# EAGLE design RaspiHub (EAGLE 6.5.0)
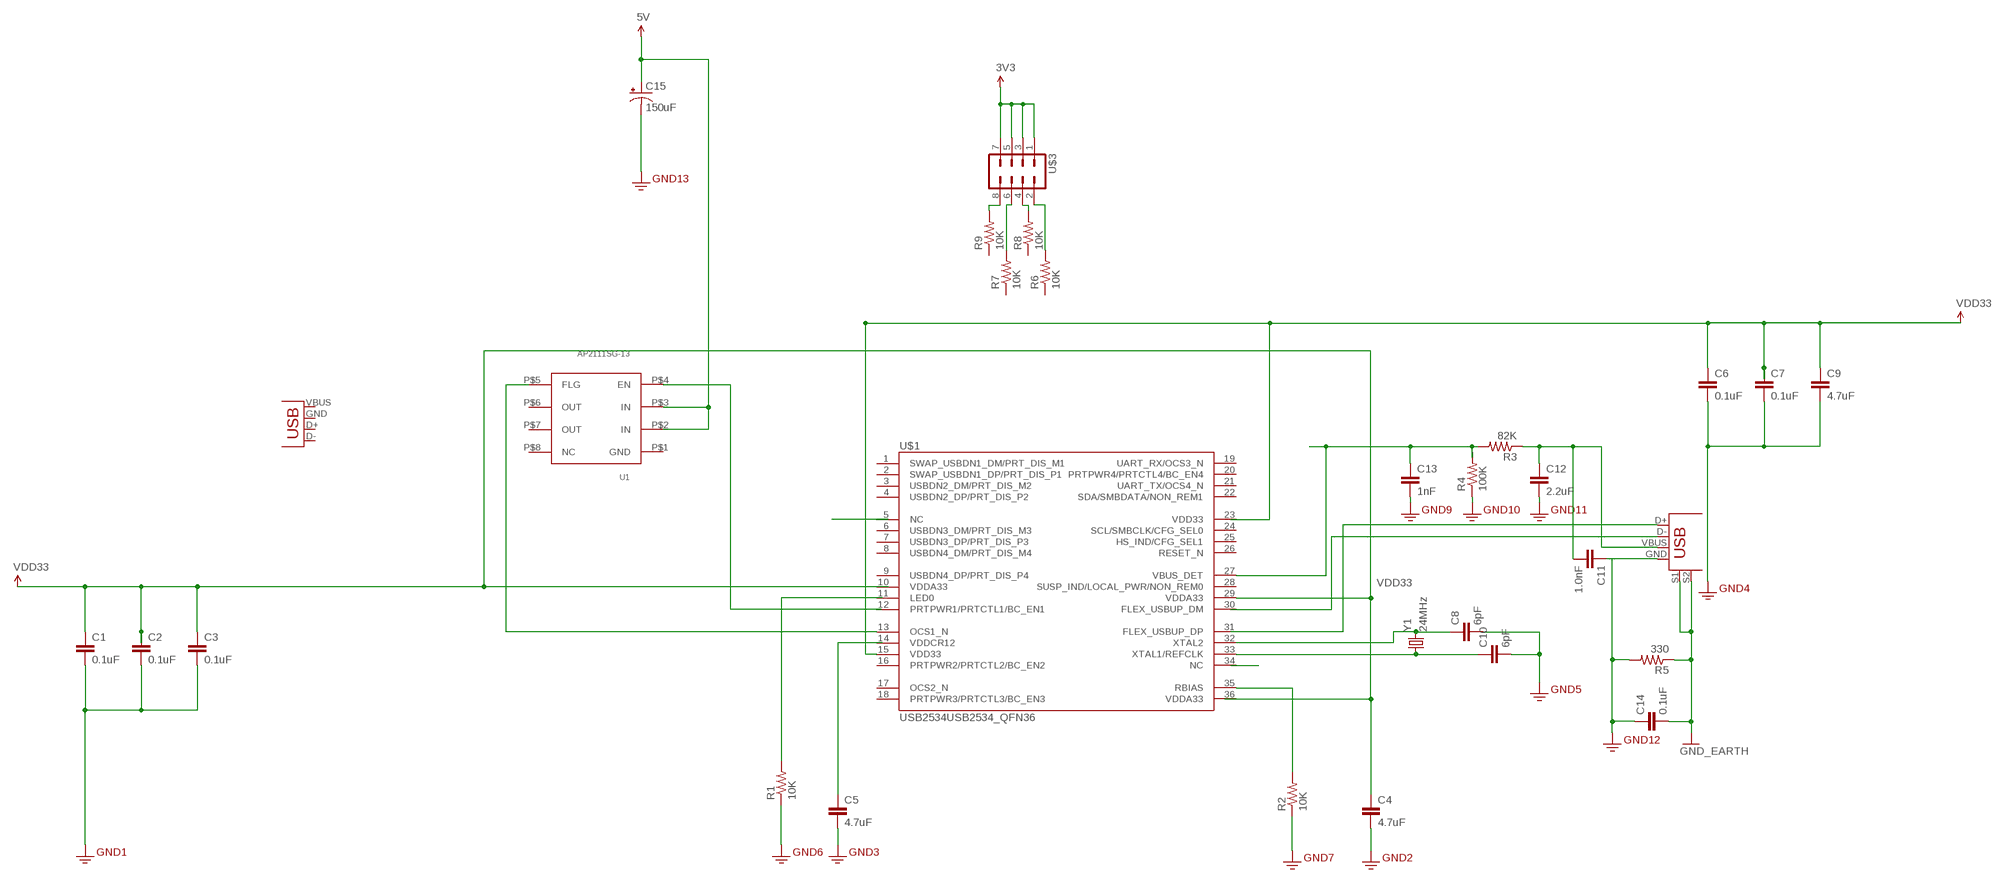
[diagram p0: schematic, sheet 1]

## Parts
C1  0.1uF  .1UF-CER  [0402-CAP]
C2  0.1uF  .1UF-CER  [0402-CAP]
C3  0.1uF  .1UF-CER  [0402-CAP]
C4  4.7uF  4.7UF-6.3V-10%(0603)0603  [0603-CAP]
C5  4.7uF  4.7UF-6.3V-10%(0603)0603  [0603-CAP]
C6  0.1uF  .1UF-CER  [0402-CAP]
C7  0.1uF  .1UF-CER  [0402-CAP]
C8  6pF  4.7UF-6.3V-10%(0603)0603  [0603-CAP]
C9  4.7uF  4.7UF-6.3V-10%(0603)0603  [0603-CAP]
C10  6pF  4.7UF-6.3V-10%(0603)0603  [0603-CAP]
C11  1.0nF  .1UF-CER  [0402-CAP]
C12  2.2uF  .1UF-CER  [0402-CAP]
C13  1nF  .1UF-CER  [0402-CAP]
C14  0.1uF  4.7UF-6.3V-10%(0603)0603  [0603-CAP]
C15  150uF  47UF-TANT  [EIA3528]
JP1  USB-A-H  [USB-A-H]
R1  10K  RESISTOR0603-RES  [0603-RES]
R2  10K  RESISTOR0603-RES  [0603-RES]
R3  82K  RESISTOR0603-RES  [0603-RES]
R4  100K  RESISTOR0603-RES  [0603-RES]
R5  330  RESISTOR0603-RES  [0603-RES]
R6  10K  RESISTOR0603-RES  [0603-RES]
R7  10K  RESISTOR0603-RES  [0603-RES]
R8  10K  RESISTOR0603-RES  [0603-RES]
R9  10K  RESISTOR0603-RES  [0603-RES]
U1  AP2111SG-13  [AP2111SG-13]
U$1  USB2534USB2534_QFN36  [USB2534]
U$2  USB+SHIELD  [USB-B-PTH]
U$3  M04X2  [2X4]
Y1  24MHz  CRYSTALHC49UV  [HC49U-V]

## Nets
3.3V: C1.2 C2.2 C3.2 C4.2 C5.2 C6.2 C7.2 C8.2 C9.2 C10.2 C12.2 C13.2 C14.1 C15.C(-) R1.1 R2.1 R4.1 R5.2 ; supply symbol labelled GND2
GND: C14.2 R5.1 U$2.S1 U$2.S2 ; supply symbol labelled GND_EARTH
N$1: C10.1 U$1.33(XTAL1/REFCLK) Y1.1
N$3: C5.1
N$5: C8.1 U$1.32(XTAL2) Y1.2
N$6: R1.2
N$7: R2.2 U$1.35(RBIAS)
N$8: U$2.D+
N$9: U$2.D-
N$10: R7.2 U$3.6
N$11: C11.2 C12.1 R3.1 U$2.VBUS
N$12: C11.1 U$2.GND
N$13: R9.2 U$3.8
N$14: R8.2 U$3.4
N$15: R6.2 U$3.2
N$16: U1.P$4(EN)
N$17: U1.P$5(FLG) U$1.13(OCS1_N)
VBUS_NET: C13.1 R3.2 U$1.27(VBUS_DET)
VCC: C6.1 C7.1 C9.1 C15.A(+) U1.P$2(IN) U1.P$3(IN) U$1.15(VDD33) U$3.1 U$3.3 U$3.5 U$3.7 ; supply symbol labelled VDD33, 3V3, 5V
VDD33: C1.1 C2.1 C3.1 U$1.29(VDDA33)
Unconnected: C4.1 JP1.D+(D-) JP1.D-(D+) JP1.GND(VBUS) JP1.VBUS(GND) R4.2 R6.1 R7.1 R8.1 R9.1 U1.P$6(OUT) U1.P$7(OUT) U1.P$8(NC) U$1.1(SWAP_USBDN1_DM/PRT_DIS_M1) U$1.2(SWAP_USBDN1_DP/PRT_DIS_P1) U$1.3(USBDN2_DM/PRT_DIS_M2) U$1.4(USBDN2_DP/PRT_DIS_P2) U$1.5(NC) U$1.6(USBDN3_DM/PRT_DIS_M3) U$1.7(USBDN3_DP/PRT_DIS_P3) U$1.8(USBDN4_DM/PRT_DIS_M4) U$1.9(USBDN4_DP/PRT_DIS_P4) U$1.10(VDDA33) U$1.11(LED0) U$1.12(PRTPWR1/PRTCTL1/BC_EN1) U$1.14(VDDCR12) U$1.16(PRTPWR2/PRTCTL2/BC_EN2) U$1.17(OCS2_N) U$1.18(PRTPWR3/PRTCTL3/BC_EN3) U$1.19(UART_RX/OCS3_N) U$1.20(PRTPWR4/PRTCTL4/BC_EN4) U$1.21(UART_TX/OCS4_N) U$1.22(SDA/SMBDATA/NON_REM1) U$1.24(SCL/SMBCLK/CFG_SEL0) U$1.25(HS_IND/CFG_SEL1) U$1.26(RESET_N) U$1.28(SUSP_IND/LOCAL_PWR/NON_REM0) U$1.30(FLEX_USBUP_DM) U$1.31(FLEX_USBUP_DP) U$1.34(NC)

## Power pins joined to a net without a drawn wire
GND: U1.P$1(GND)
VDD33: U$1.23(VDD33)
VDDA33: U$1.36(VDDA33)

## Library data of the parts
C1-C3 C6 C7 = SparkFun-Capacitors:.1UF-CER: .1uF ceramic SMT CAP-00810- 25V +80%/-20% (0603) CAP-08390- 100V 10% (0603) CAP-08604- 25V 5% (0603); PROD_ID: CAP-00810
C4 C5 C9 = SparkFun-Capacitors:4.7UF-6.3V-10%(0603): CAP-08280; PROD_ID: CAP-08280
C8 C10 C14 = SparkFun-Capacitors:4.7UF-6.3V-10%(0603): CAP-08280; PROD_ID: CAP-08280; VALUE: 4.7uF
C11-C13 = SparkFun-Capacitors:.1UF-CER: .1uF ceramic SMT CAP-00810- 25V +80%/-20% (0603) CAP-08390- 100V 10% (0603) CAP-08604- 25V 5% (0603); PROD_ID: CAP-00810; VALUE: 0.1uF
C15 = SparkFun-Capacitors:47UF-TANT: 47uF Tantalum SMT CAP-08310- 10V 10% (EIA-3528); PROD_ID: CAP-08310; VALUE: 47uF
JP1 = SparkFun-Connectors:USB: USB Connectors USB-B-PTH is fully proven SKU : PRT-00139/CONN-08278 USB-miniB is fully proven SKU : PRT-00587 USB-A-PCB is untested. USB-A-H is throughly reviewed, but untested. Spark Fun Electronics SKU : PRT-00437 USB-B-SMT is throughly reviewed, but untested. Needs silkscreen touching up. USB-A-S has not been used/tested USB-MB-H has not been used/tested USB-MICROB has been used. CONN-09505
R1-R9 = SparkFun-Resistors:RESISTOR: Resistor Basic schematic elements and footprints for 0603, 1206, and PTH resistors.
U1 = RaspiHub:AP2111SG-13: AP2111SG-13 - 2A SINGLE CHANNEL CURRENT-LIMITED POWER SWITCH Mouser: 621-AP2111SG-13
U$1 = RaspiHub:USB2534
U$2 = SparkFun-Connectors:USB+SHIELD: USB+Shield USB connector with shield pins connectable
U$3 = SparkFun-Connectors:M04X2: .1" header, two rows of four.
Y1 = SparkFun-FreqCtrl:CRYSTAL: Various standard crystals. Proven footprints. Spark Fun Electronics SKU : COM-00534

## Board
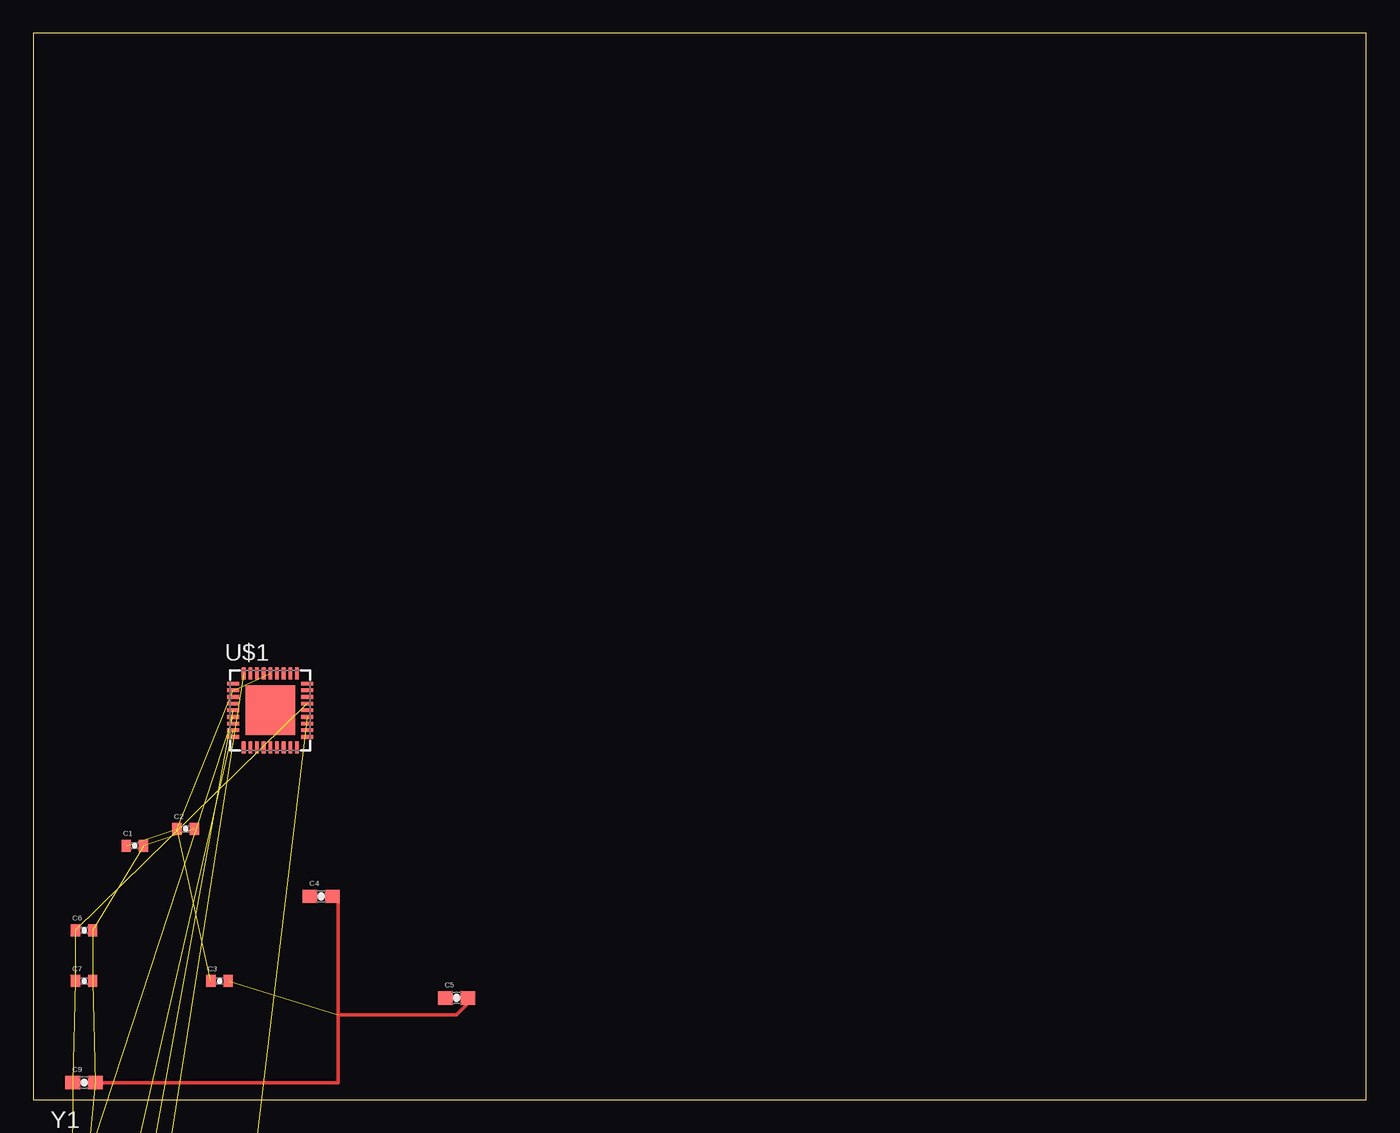
[diagram p1: board, top side]

Size 100 x 80 mm. Coordinates in mm from the lower left corner, seen from the top.
Outline: 0,0 100,0 100,80 0,80 0,0
Copper layers (1*16): Top 0.035mm / dielectric 1.5mm / Bottom 0.035mm
Design rules "default": minimum track width 10mil, minimum drill 24mil, track to track 8mil, track to pad 8mil, pad to pad 8mil, via to via 8mil, smd to smd 8mil, copper to edge 40mil, drill to drill 8mil, minimum pad ring 10mil, minimum via ring 8mil, stop-mask expansion 4mil, vias tented up to drill 0mil, thermal gap 10mil

### Footprints (pad centres in the part's own frame; a part is rotated, then mirrored left to right if it is on the bottom)
0402-CAP = smd 0.7 x 0.9: 1 -0.65,0; 2 0.65,0
0603-CAP = smd 1.1 x 1: 1 -0.85,0; 2 0.85,0
EIA3528 = smd 1.2 x 2.5: A 1.65,0; C -1.65,0
USB-A-H = drill 0.914 pad 1.88: D+ 2.4,1.127; D- 2.4,-1.127; GND 2.4,3.5; VBUS 2.4,-3.5 | drill 2.2: GND2 0,-5.8; GND3 0,5.8 | hole 1.1: -0.1,2.25; -0.1,-2.25
0603-RES = smd 1.1 x 1: 1 -0.85,0; 2 0.85,0
AP2111SG-13 = smd 0.6 x 1.55: P$1 -1.905,-2.7; P$2 -0.635,-2.7; P$3 0.635,-2.7; P$4 1.905,-2.7; P$5 1.905,2.7; P$6 0.635,2.7; P$7 -0.635,2.7; P$8 -1.905,2.7
USB2534 = smd 0.28 x 0.9: 1 -2,-2.775; 2 -1.5,-2.775; 3 -1,-2.775; 4 -0.5,-2.775; 5 0,-2.775; 6 0.5,-2.775; 7 1,-2.775; 8 1.5,-2.775; 9 2,-2.775; 19 2,2.775; 20 1.5,2.775; 21 1,2.775; 22 0.5,2.775; 23 0,2.775; 24 -0.5,2.775; 25 -1,2.775; 26 -1.5,2.775; 27 -2,2.775 | smd 0.9 x 0.28: 10 2.775,-2; 11 2.775,-1.5; 12 2.775,-1; 13 2.775,-0.5; 14 2.775,0; 15 2.775,0.5; 16 2.775,1; 17 2.775,1.5; 18 2.775,2; 28 -2.775,2; 29 -2.775,1.5; 30 -2.775,1; 31 -2.775,0.5; 32 -2.775,0; 33 -2.775,-0.5; 34 -2.775,-1; 35 -2.775,-1.5; 36 -2.775,-2 | smd 3.7 x 3.7: GRD 0,0
USB-B-PTH = drill 0.914 pad 1.676: D+ 0,1.25; D- 1.981,1.25; GND 0,-1.25; VBUS 1.981,-1.25 | drill 2.286: S1 -2.718,-6.02; S2 -2.718,6.02
2X4 = drill 1.016 pad 1.88 octagon: 1 -3.81,-1.27; 2 -3.81,1.27; 3 -1.27,-1.27; 4 -1.27,1.27; 5 1.27,-1.27; 6 1.27,1.27; 7 3.81,-1.27; 8 3.81,1.27
HC49U-V = drill 0.813: 1 -2.413,0; 2 2.413,0

### Placement (x,y rotation side)
C1  7.62,19.05 0 top
C2  11.43,20.32 0 top
C3  13.97,8.89 0 top
C4  21.59,15.24 0 top
C5  31.75,7.62 0 top
C6  3.81,12.7 0 top
C7  3.81,8.89 0 top
C8  2.54,-11.43 0 top  (outside the outline)
C9  3.81,1.27 0 top
C10  2.54,-15.24 0 top  (outside the outline)
C11  2.54,-43.18 0 top  (outside the outline)
C12  2.54,-54.61 0 top  (outside the outline)
C13  2.54,-58.42 0 top  (outside the outline)
C14  2.54,-66.04 0 top  (outside the outline)
C15  -3.81,-99.06 0 top  (outside the outline)
JP1  10.16,-110.49 0 top  (outside the outline)
R1  2.54,-19.05 0 top  (outside the outline)
R2  2.54,-22.86 0 top  (outside the outline)
R3  2.54,-46.99 0 top  (outside the outline)
R4  2.54,-50.8 0 top  (outside the outline)
R5  2.54,-62.23 0 top  (outside the outline)
R6  2.54,-80.01 0 top  (outside the outline)
R7  2.54,-83.82 0 top  (outside the outline)
R8  2.54,-87.63 0 top  (outside the outline)
R9  2.54,-91.44 0 top  (outside the outline)
U1  3.81,-97.79 0 top  (outside the outline)
U$1  17.78,29.21 0 top
U$2  12.7,-33.02 0 top  (outside the outline)
U$3  6.35,-73.66 0 top  (outside the outline)
Y1  6.35,-5.08 0 top  (outside the outline)

### Tracks (layer width: path | path; a pad name or v marks a point on that pad's centre or on a via)
3.3V  (15 unrouted)
  Top 0.254: C9.2 22.86,1.27 22.86,6.35 | 22.86,6.35 22.86,15.24 C4.2 | 22.86,6.35 31.75,6.35 33.02,7.62 C5.2
GND  (4 unrouted)
N$1  (2 unrouted)
N$5  (2 unrouted)
N$7  (1 unrouted)
N$10  (1 unrouted)
N$11  (3 unrouted)
N$12  (1 unrouted)
N$13  (1 unrouted)
N$14  (1 unrouted)
N$15  (1 unrouted)
N$17  (1 unrouted)
VBUS_NET  (2 unrouted)
VCC  (10 unrouted)
VDD33  (4 unrouted)